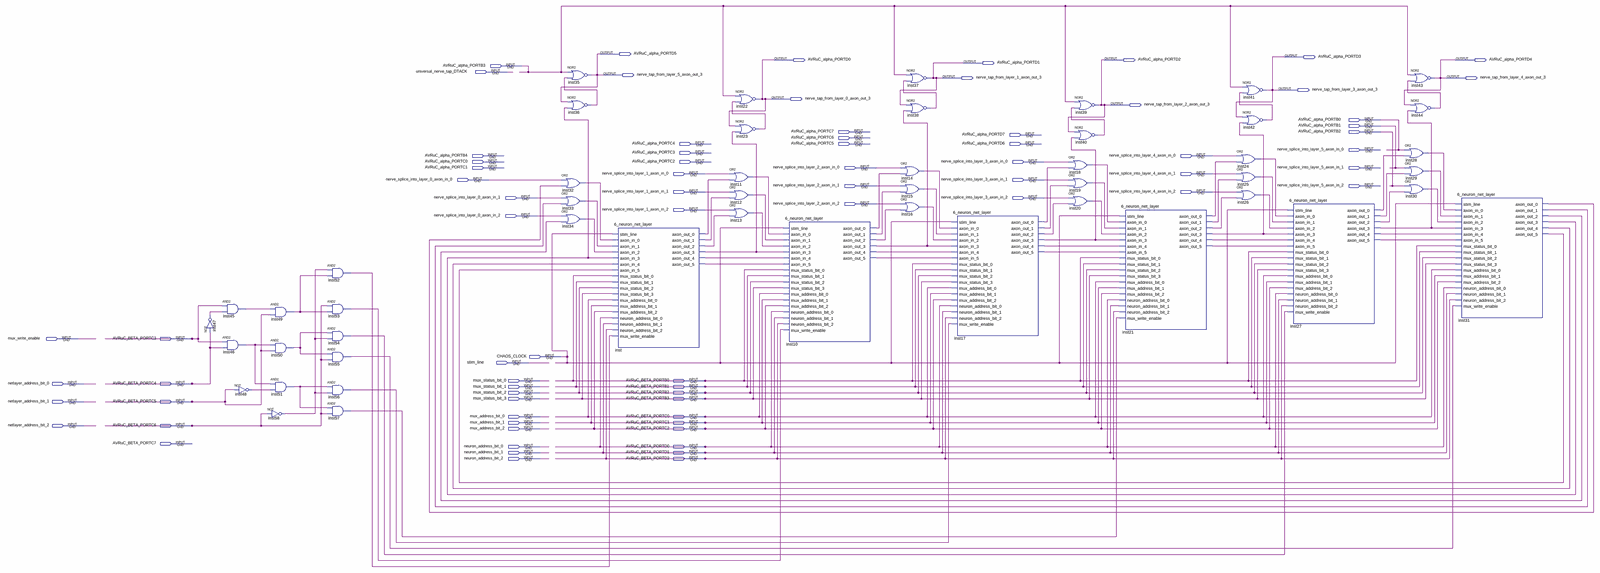
[diagram p0: schematic sheet, whole]
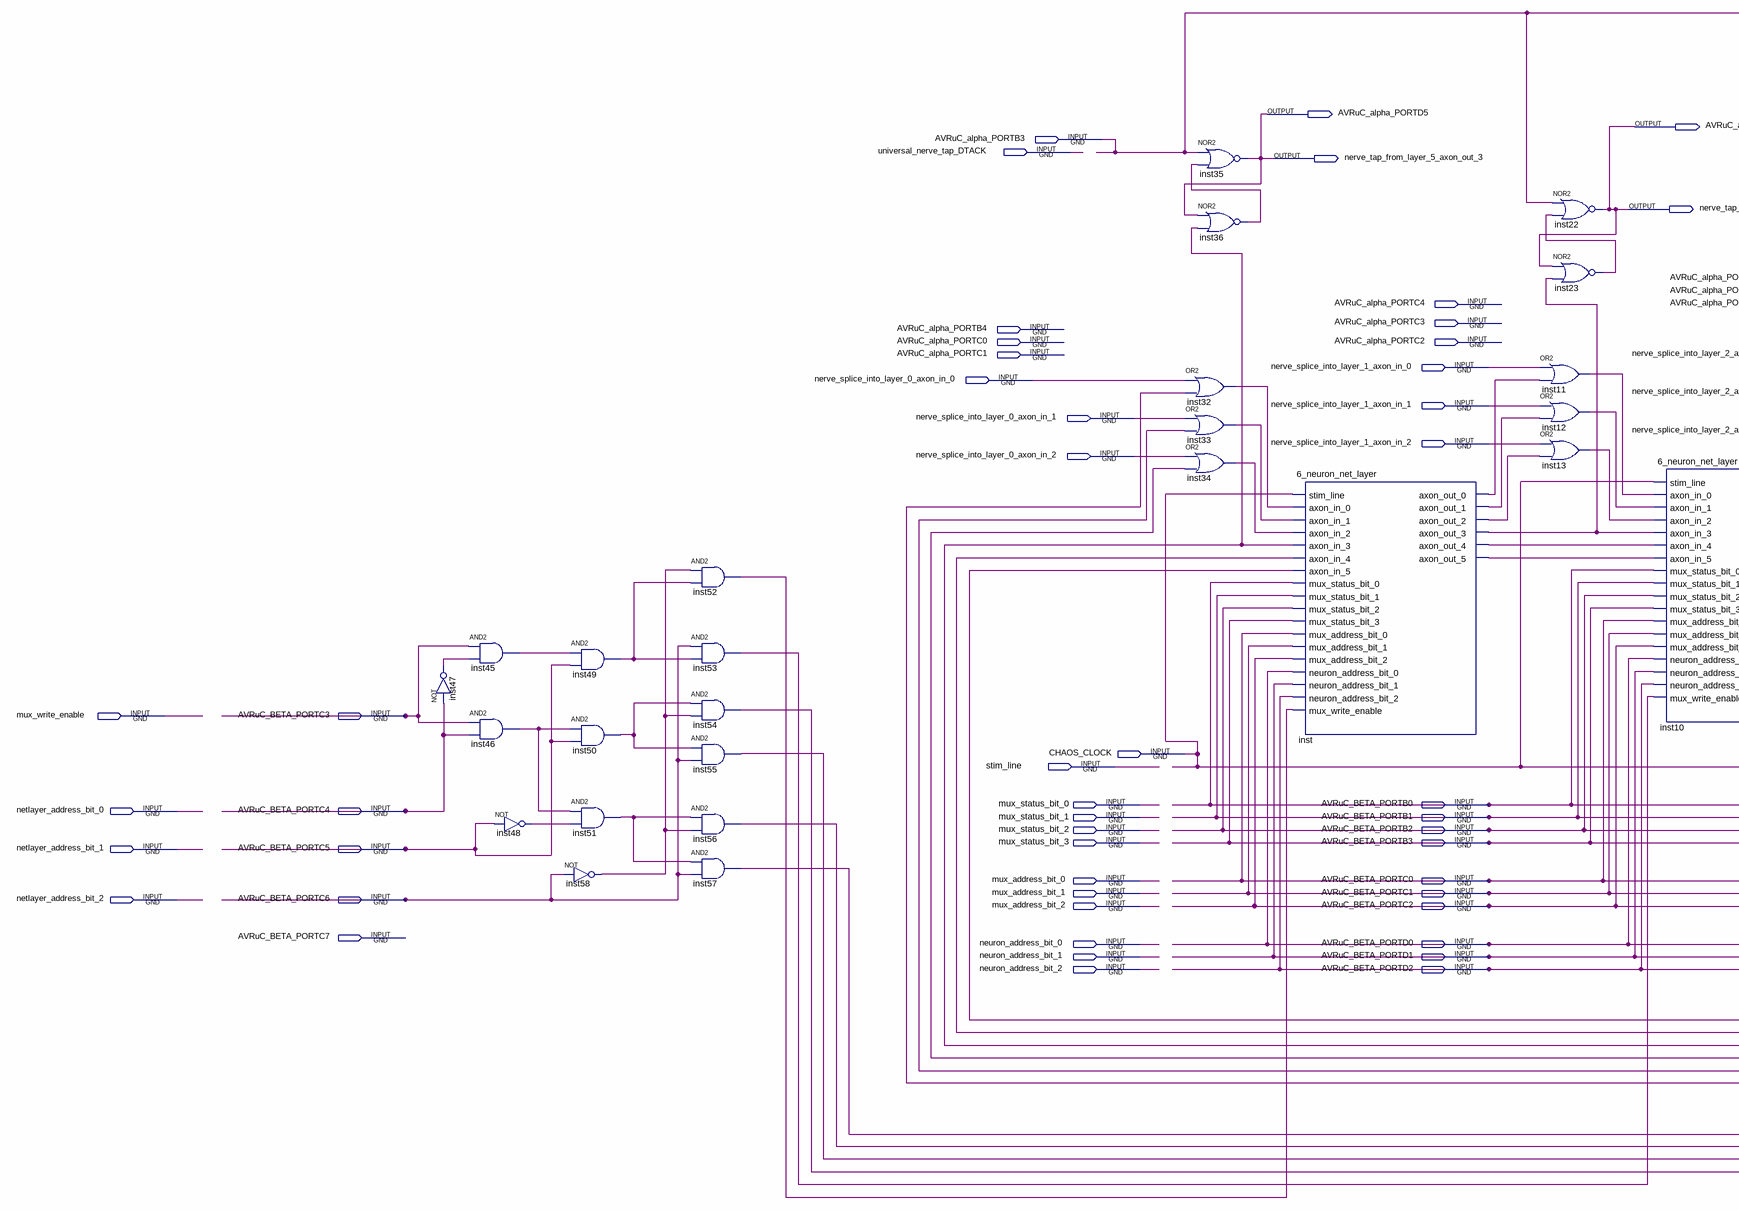
[diagram p1: schematic sheet, left part]
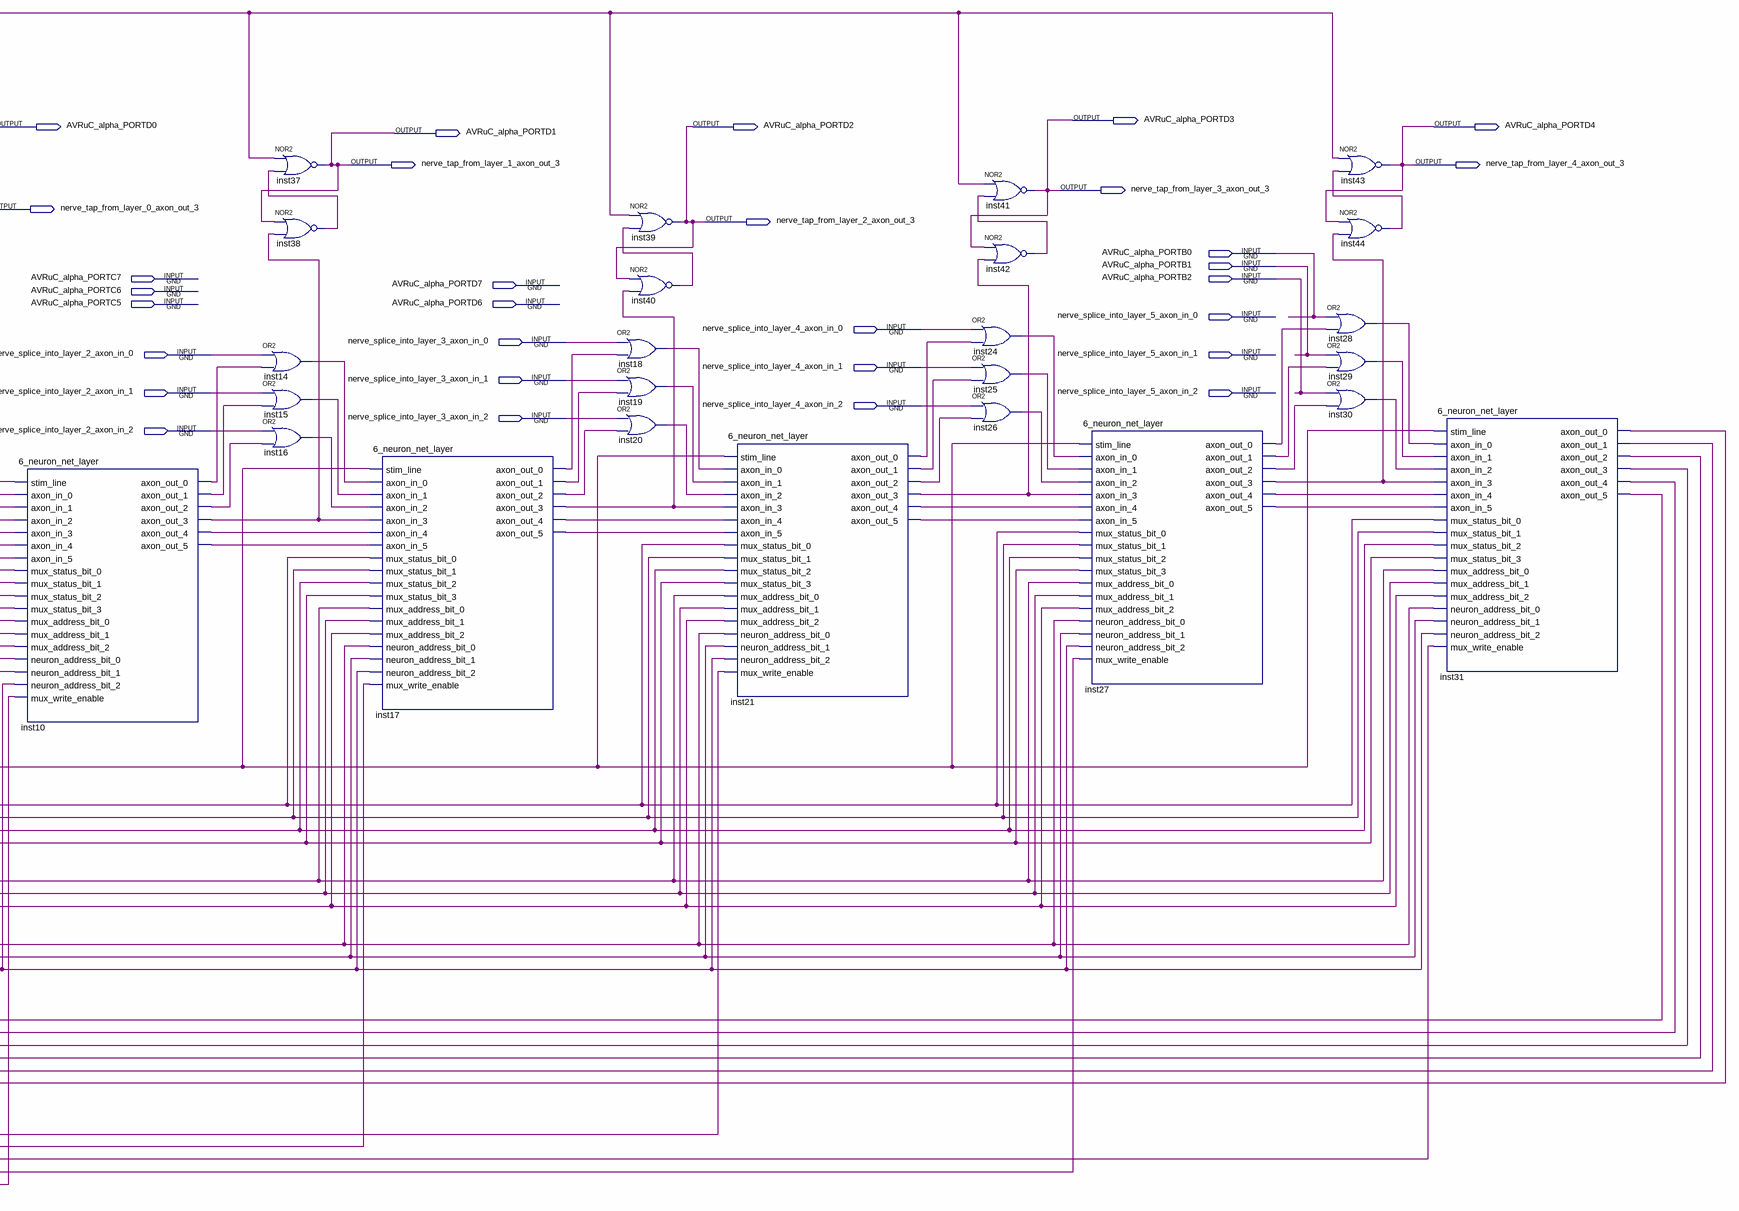
[diagram p2: schematic sheet, right part]
// Quartus schematic xenolux_top_layer.bdf as structural Verilog: 50 symbols, 77 pins
module xenolux_top_layer (
  input  AVRuC_alpha_PORTB3,
  input  universal_nerve_tap_DTACK,
  input  AVRuC_alpha_PORTB0,
  input  AVRuC_alpha_PORTB1,
  input  AVRuC_alpha_PORTC7,
  input  AVRuC_alpha_PORTB2,
  input  AVRuC_alpha_PORTD7,
  input  AVRuC_alpha_PORTC6,
  input  AVRuC_alpha_PORTC4,
  input  AVRuC_alpha_PORTC5,
  input  AVRuC_alpha_PORTD6,
  input  nerve_splice_into_layer_5_axon_in_0,
  input  AVRuC_alpha_PORTC3,
  input  AVRuC_alpha_PORTB4,
  input  nerve_splice_into_layer_4_axon_in_0,
  input  AVRuC_alpha_PORTC0,
  input  AVRuC_alpha_PORTC2,
  input  nerve_splice_into_layer_3_axon_in_0,
  input  AVRuC_alpha_PORTC1,
  input  nerve_splice_into_layer_2_axon_in_0,
  input  nerve_splice_into_layer_5_axon_in_1,
  input  nerve_splice_into_layer_1_axon_in_0,
  input  nerve_splice_into_layer_4_axon_in_1,
  input  nerve_splice_into_layer_0_axon_in_0,
  input  nerve_splice_into_layer_3_axon_in_1,
  input  nerve_splice_into_layer_2_axon_in_1,
  input  nerve_splice_into_layer_5_axon_in_2,
  input  nerve_splice_into_layer_1_axon_in_1,
  input  nerve_splice_into_layer_4_axon_in_2,
  input  nerve_splice_into_layer_0_axon_in_1,
  input  nerve_splice_into_layer_3_axon_in_2,
  input  nerve_splice_into_layer_2_axon_in_2,
  input  nerve_splice_into_layer_1_axon_in_2,
  input  nerve_splice_into_layer_0_axon_in_2,
  input  mux_write_enable,
  input  AVRuC_BETA_PORTC3,
  input  CHAOS_CLOCK,
  input  stim_line,
  input  mux_status_bit_0,
  input  AVRuC_BETA_PORTB0,
  input  netlayer_address_bit_0,
  input  AVRuC_BETA_PORTC4,
  input  mux_status_bit_1,
  input  AVRuC_BETA_PORTB1,
  input  mux_status_bit_2,
  input  AVRuC_BETA_PORTB2,
  input  mux_status_bit_3,
  input  AVRuC_BETA_PORTB3,
  input  netlayer_address_bit_1,
  input  AVRuC_BETA_PORTC5,
  input  mux_address_bit_0,
  input  AVRuC_BETA_PORTC0,
  input  mux_address_bit_1,
  input  AVRuC_BETA_PORTC1,
  input  netlayer_address_bit_2,
  input  AVRuC_BETA_PORTC6,
  input  mux_address_bit_2,
  input  AVRuC_BETA_PORTC2,
  input  AVRuC_BETA_PORTC7,
  input  neuron_address_bit_0,
  input  AVRuC_BETA_PORTD0,
  input  neuron_address_bit_1,
  input  AVRuC_BETA_PORTD1,
  input  neuron_address_bit_2,
  input  AVRuC_BETA_PORTD2,
  output AVRuC_alpha_PORTD5,
  output AVRuC_alpha_PORTD3,
  output AVRuC_alpha_PORTD0,
  output AVRuC_alpha_PORTD2,
  output AVRuC_alpha_PORTD4,
  output AVRuC_alpha_PORTD1,
  output nerve_tap_from_layer_5_axon_out_3,
  output nerve_tap_from_layer_1_axon_out_3,
  output nerve_tap_from_layer_4_axon_out_3,
  output nerve_tap_from_layer_3_axon_out_3,
  output nerve_tap_from_layer_0_axon_out_3,
  output nerve_tap_from_layer_2_axon_out_3
);

  wire inst10_axon_out_0, inst10_axon_out_1, inst10_axon_out_2, inst10_axon_out_3, inst10_axon_out_4,
       inst10_axon_out_5, inst11_out, inst12_out, inst13_out, inst14_out, inst15_out, inst16_out,
       inst17_axon_out_0, inst17_axon_out_1, inst17_axon_out_2, inst17_axon_out_3, inst17_axon_out_4,
       inst17_axon_out_5, inst18_out, inst19_out, inst20_out, inst21_axon_out_0, inst21_axon_out_1,
       inst21_axon_out_2, inst21_axon_out_3, inst21_axon_out_4, inst21_axon_out_5, inst23_out, inst24_out,
       inst25_out, inst26_out, inst27_axon_out_0, inst27_axon_out_1, inst27_axon_out_2, inst27_axon_out_3,
       inst27_axon_out_4, inst27_axon_out_5, inst28_out, inst29_out, inst30_out, inst31_axon_out_0,
       inst31_axon_out_1, inst31_axon_out_2, inst31_axon_out_3, inst31_axon_out_4, inst31_axon_out_5,
       inst32_out, inst33_out, inst34_out, inst36_out, inst38_out, inst40_out, inst42_out, inst44_out,
       inst45_out, inst46_out, inst47_out, inst48_out, inst49_out, inst50_out, inst51_out, inst52_out,
       inst53_out, inst54_out, inst55_out, inst56_out, inst57_out, inst58_out, inst_axon_out_0,
       inst_axon_out_1, inst_axon_out_2, inst_axon_out_3, inst_axon_out_4, inst_axon_out_5;

  not inst47 (inst47_out, AVRuC_BETA_PORTC4);
  and inst45 (inst45_out, AVRuC_BETA_PORTC3, inst47_out);
  and inst46 (inst46_out, AVRuC_BETA_PORTC3, AVRuC_BETA_PORTC4);
  not inst48 (inst48_out, AVRuC_BETA_PORTC5);
  and inst49 (inst49_out, inst45_out, AVRuC_BETA_PORTC5);
  and inst50 (inst50_out, inst46_out, AVRuC_BETA_PORTC5);
  and inst51 (inst51_out, inst46_out, inst48_out);
  not inst58 (inst58_out, AVRuC_BETA_PORTC6);
  and inst52 (inst52_out, inst58_out, inst49_out);
  and inst53 (inst53_out, AVRuC_BETA_PORTC6, inst49_out);
  and inst54 (inst54_out, inst50_out, inst58_out);
  and inst55 (inst55_out, inst50_out, AVRuC_BETA_PORTC6);
  and inst56 (inst56_out, inst51_out, inst58_out);
  and inst57 (inst57_out, inst51_out, AVRuC_BETA_PORTC6);
  nor inst35 (AVRuC_alpha_PORTD5, AVRuC_alpha_PORTB3, inst36_out);
  nor inst36 (inst36_out, AVRuC_alpha_PORTD5, inst31_axon_out_3);
  or inst32 (inst32_out, nerve_splice_into_layer_0_axon_in_0, inst31_axon_out_0);
  or inst33 (inst33_out, nerve_splice_into_layer_0_axon_in_1, inst31_axon_out_1);
  or inst34 (inst34_out, nerve_splice_into_layer_0_axon_in_2, inst31_axon_out_2);
  \6_neuron_net_layer  inst (
    .stim_line(CHAOS_CLOCK), .axon_in_0(inst32_out), .axon_in_1(inst33_out), .axon_in_2(inst34_out),
    .axon_in_3(inst31_axon_out_3), .axon_in_4(inst31_axon_out_4), .axon_in_5(inst31_axon_out_5),
    .mux_status_bit_0(AVRuC_BETA_PORTB0), .mux_status_bit_1(AVRuC_BETA_PORTB1),
    .mux_status_bit_2(AVRuC_BETA_PORTB2), .mux_status_bit_3(AVRuC_BETA_PORTB3),
    .mux_address_bit_0(AVRuC_BETA_PORTC0), .mux_address_bit_1(AVRuC_BETA_PORTC1),
    .mux_address_bit_2(AVRuC_BETA_PORTC2), .neuron_address_bit_0(AVRuC_BETA_PORTD0),
    .neuron_address_bit_1(AVRuC_BETA_PORTD1), .neuron_address_bit_2(AVRuC_BETA_PORTD2),
    .mux_write_enable(inst52_out), .axon_out_0(inst_axon_out_0), .axon_out_1(inst_axon_out_1),
    .axon_out_2(inst_axon_out_2), .axon_out_3(inst_axon_out_3), .axon_out_4(inst_axon_out_4),
    .axon_out_5(inst_axon_out_5));
  nor inst22 (AVRuC_alpha_PORTD0, AVRuC_alpha_PORTB3, inst23_out);
  nor inst23 (inst23_out, AVRuC_alpha_PORTD0, inst_axon_out_3);
  or inst11 (inst11_out, nerve_splice_into_layer_1_axon_in_0, inst_axon_out_0);
  or inst12 (inst12_out, nerve_splice_into_layer_1_axon_in_1, inst_axon_out_1);
  or inst13 (inst13_out, nerve_splice_into_layer_1_axon_in_2, inst_axon_out_2);
  \6_neuron_net_layer  inst10 (
    .stim_line(CHAOS_CLOCK), .axon_in_0(inst11_out), .axon_in_1(inst12_out), .axon_in_2(inst13_out),
    .axon_in_3(inst_axon_out_3), .axon_in_4(inst_axon_out_4), .axon_in_5(inst_axon_out_5),
    .mux_status_bit_0(AVRuC_BETA_PORTB0), .mux_status_bit_1(AVRuC_BETA_PORTB1),
    .mux_status_bit_2(AVRuC_BETA_PORTB2), .mux_status_bit_3(AVRuC_BETA_PORTB3),
    .mux_address_bit_0(AVRuC_BETA_PORTC0), .mux_address_bit_1(AVRuC_BETA_PORTC1),
    .mux_address_bit_2(AVRuC_BETA_PORTC2), .neuron_address_bit_0(AVRuC_BETA_PORTD0),
    .neuron_address_bit_1(AVRuC_BETA_PORTD1), .neuron_address_bit_2(AVRuC_BETA_PORTD2),
    .mux_write_enable(inst53_out), .axon_out_0(inst10_axon_out_0), .axon_out_1(inst10_axon_out_1),
    .axon_out_2(inst10_axon_out_2), .axon_out_3(inst10_axon_out_3), .axon_out_4(inst10_axon_out_4),
    .axon_out_5(inst10_axon_out_5));
  nor inst37 (AVRuC_alpha_PORTD1, AVRuC_alpha_PORTB3, inst38_out);
  nor inst38 (inst38_out, AVRuC_alpha_PORTD1, inst10_axon_out_3);
  or inst14 (inst14_out, nerve_splice_into_layer_2_axon_in_0, inst10_axon_out_0);
  or inst15 (inst15_out, nerve_splice_into_layer_2_axon_in_1, inst10_axon_out_1);
  or inst16 (inst16_out, nerve_splice_into_layer_2_axon_in_2, inst10_axon_out_2);
  \6_neuron_net_layer  inst17 (
    .stim_line(CHAOS_CLOCK), .axon_in_0(inst14_out), .axon_in_1(inst15_out), .axon_in_2(inst16_out),
    .axon_in_3(inst10_axon_out_3), .axon_in_4(inst10_axon_out_4), .axon_in_5(inst10_axon_out_5),
    .mux_status_bit_0(AVRuC_BETA_PORTB0), .mux_status_bit_1(AVRuC_BETA_PORTB1),
    .mux_status_bit_2(AVRuC_BETA_PORTB2), .mux_status_bit_3(AVRuC_BETA_PORTB3),
    .mux_address_bit_0(AVRuC_BETA_PORTC0), .mux_address_bit_1(AVRuC_BETA_PORTC1),
    .mux_address_bit_2(AVRuC_BETA_PORTC2), .neuron_address_bit_0(AVRuC_BETA_PORTD0),
    .neuron_address_bit_1(AVRuC_BETA_PORTD1), .neuron_address_bit_2(AVRuC_BETA_PORTD2),
    .mux_write_enable(inst56_out), .axon_out_0(inst17_axon_out_0), .axon_out_1(inst17_axon_out_1),
    .axon_out_2(inst17_axon_out_2), .axon_out_3(inst17_axon_out_3), .axon_out_4(inst17_axon_out_4),
    .axon_out_5(inst17_axon_out_5));
  nor inst39 (AVRuC_alpha_PORTD2, AVRuC_alpha_PORTB3, inst40_out);
  nor inst40 (inst40_out, AVRuC_alpha_PORTD2, inst17_axon_out_3);
  or inst18 (inst18_out, nerve_splice_into_layer_3_axon_in_0, inst17_axon_out_0);
  or inst19 (inst19_out, nerve_splice_into_layer_3_axon_in_1, inst17_axon_out_1);
  or inst20 (inst20_out, nerve_splice_into_layer_3_axon_in_2, inst17_axon_out_2);
  \6_neuron_net_layer  inst21 (
    .stim_line(CHAOS_CLOCK), .axon_in_0(inst18_out), .axon_in_1(inst19_out), .axon_in_2(inst20_out),
    .axon_in_3(inst17_axon_out_3), .axon_in_4(inst17_axon_out_4), .axon_in_5(inst17_axon_out_5),
    .mux_status_bit_0(AVRuC_BETA_PORTB0), .mux_status_bit_1(AVRuC_BETA_PORTB1),
    .mux_status_bit_2(AVRuC_BETA_PORTB2), .mux_status_bit_3(AVRuC_BETA_PORTB3),
    .mux_address_bit_0(AVRuC_BETA_PORTC0), .mux_address_bit_1(AVRuC_BETA_PORTC1),
    .mux_address_bit_2(AVRuC_BETA_PORTC2), .neuron_address_bit_0(AVRuC_BETA_PORTD0),
    .neuron_address_bit_1(AVRuC_BETA_PORTD1), .neuron_address_bit_2(AVRuC_BETA_PORTD2),
    .mux_write_enable(inst57_out), .axon_out_0(inst21_axon_out_0), .axon_out_1(inst21_axon_out_1),
    .axon_out_2(inst21_axon_out_2), .axon_out_3(inst21_axon_out_3), .axon_out_4(inst21_axon_out_4),
    .axon_out_5(inst21_axon_out_5));
  nor inst41 (AVRuC_alpha_PORTD3, AVRuC_alpha_PORTB3, inst42_out);
  nor inst42 (inst42_out, AVRuC_alpha_PORTD3, inst21_axon_out_3);
  or inst24 (inst24_out, nerve_splice_into_layer_4_axon_in_0, inst21_axon_out_0);
  or inst25 (inst25_out, nerve_splice_into_layer_4_axon_in_1, inst21_axon_out_1);
  or inst26 (inst26_out, nerve_splice_into_layer_4_axon_in_2, inst21_axon_out_2);
  \6_neuron_net_layer  inst27 (
    .stim_line(CHAOS_CLOCK), .axon_in_0(inst24_out), .axon_in_1(inst25_out), .axon_in_2(inst26_out),
    .axon_in_3(inst21_axon_out_3), .axon_in_4(inst21_axon_out_4), .axon_in_5(inst21_axon_out_5),
    .mux_status_bit_0(AVRuC_BETA_PORTB0), .mux_status_bit_1(AVRuC_BETA_PORTB1),
    .mux_status_bit_2(AVRuC_BETA_PORTB2), .mux_status_bit_3(AVRuC_BETA_PORTB3),
    .mux_address_bit_0(AVRuC_BETA_PORTC0), .mux_address_bit_1(AVRuC_BETA_PORTC1),
    .mux_address_bit_2(AVRuC_BETA_PORTC2), .neuron_address_bit_0(AVRuC_BETA_PORTD0),
    .neuron_address_bit_1(AVRuC_BETA_PORTD1), .neuron_address_bit_2(AVRuC_BETA_PORTD2),
    .mux_write_enable(inst54_out), .axon_out_0(inst27_axon_out_0), .axon_out_1(inst27_axon_out_1),
    .axon_out_2(inst27_axon_out_2), .axon_out_3(inst27_axon_out_3), .axon_out_4(inst27_axon_out_4),
    .axon_out_5(inst27_axon_out_5));
  nor inst43 (AVRuC_alpha_PORTD4, AVRuC_alpha_PORTB3, inst44_out);
  nor inst44 (inst44_out, AVRuC_alpha_PORTD4, inst27_axon_out_3);
  or inst28 (inst28_out, AVRuC_alpha_PORTB0, inst27_axon_out_0);
  or inst29 (inst29_out, AVRuC_alpha_PORTB1, inst27_axon_out_1);
  or inst30 (inst30_out, AVRuC_alpha_PORTB2, inst27_axon_out_2);
  \6_neuron_net_layer  inst31 (
    .stim_line(CHAOS_CLOCK), .axon_in_0(inst28_out), .axon_in_1(inst29_out), .axon_in_2(inst30_out),
    .axon_in_3(inst27_axon_out_3), .axon_in_4(inst27_axon_out_4), .axon_in_5(inst27_axon_out_5),
    .mux_status_bit_0(AVRuC_BETA_PORTB0), .mux_status_bit_1(AVRuC_BETA_PORTB1),
    .mux_status_bit_2(AVRuC_BETA_PORTB2), .mux_status_bit_3(AVRuC_BETA_PORTB3),
    .mux_address_bit_0(AVRuC_BETA_PORTC0), .mux_address_bit_1(AVRuC_BETA_PORTC1),
    .mux_address_bit_2(AVRuC_BETA_PORTC2), .neuron_address_bit_0(AVRuC_BETA_PORTD0),
    .neuron_address_bit_1(AVRuC_BETA_PORTD1), .neuron_address_bit_2(AVRuC_BETA_PORTD2),
    .mux_write_enable(inst55_out), .axon_out_0(inst31_axon_out_0), .axon_out_1(inst31_axon_out_1),
    .axon_out_2(inst31_axon_out_2), .axon_out_3(inst31_axon_out_3), .axon_out_4(inst31_axon_out_4),
    .axon_out_5(inst31_axon_out_5));

  assign nerve_tap_from_layer_0_axon_out_3 = AVRuC_alpha_PORTD0;
  assign nerve_tap_from_layer_1_axon_out_3 = AVRuC_alpha_PORTD1;
  assign nerve_tap_from_layer_2_axon_out_3 = AVRuC_alpha_PORTD2;
  assign nerve_tap_from_layer_3_axon_out_3 = AVRuC_alpha_PORTD3;
  assign nerve_tap_from_layer_4_axon_out_3 = AVRuC_alpha_PORTD4;
  assign nerve_tap_from_layer_5_axon_out_3 = AVRuC_alpha_PORTD5;
endmodule
